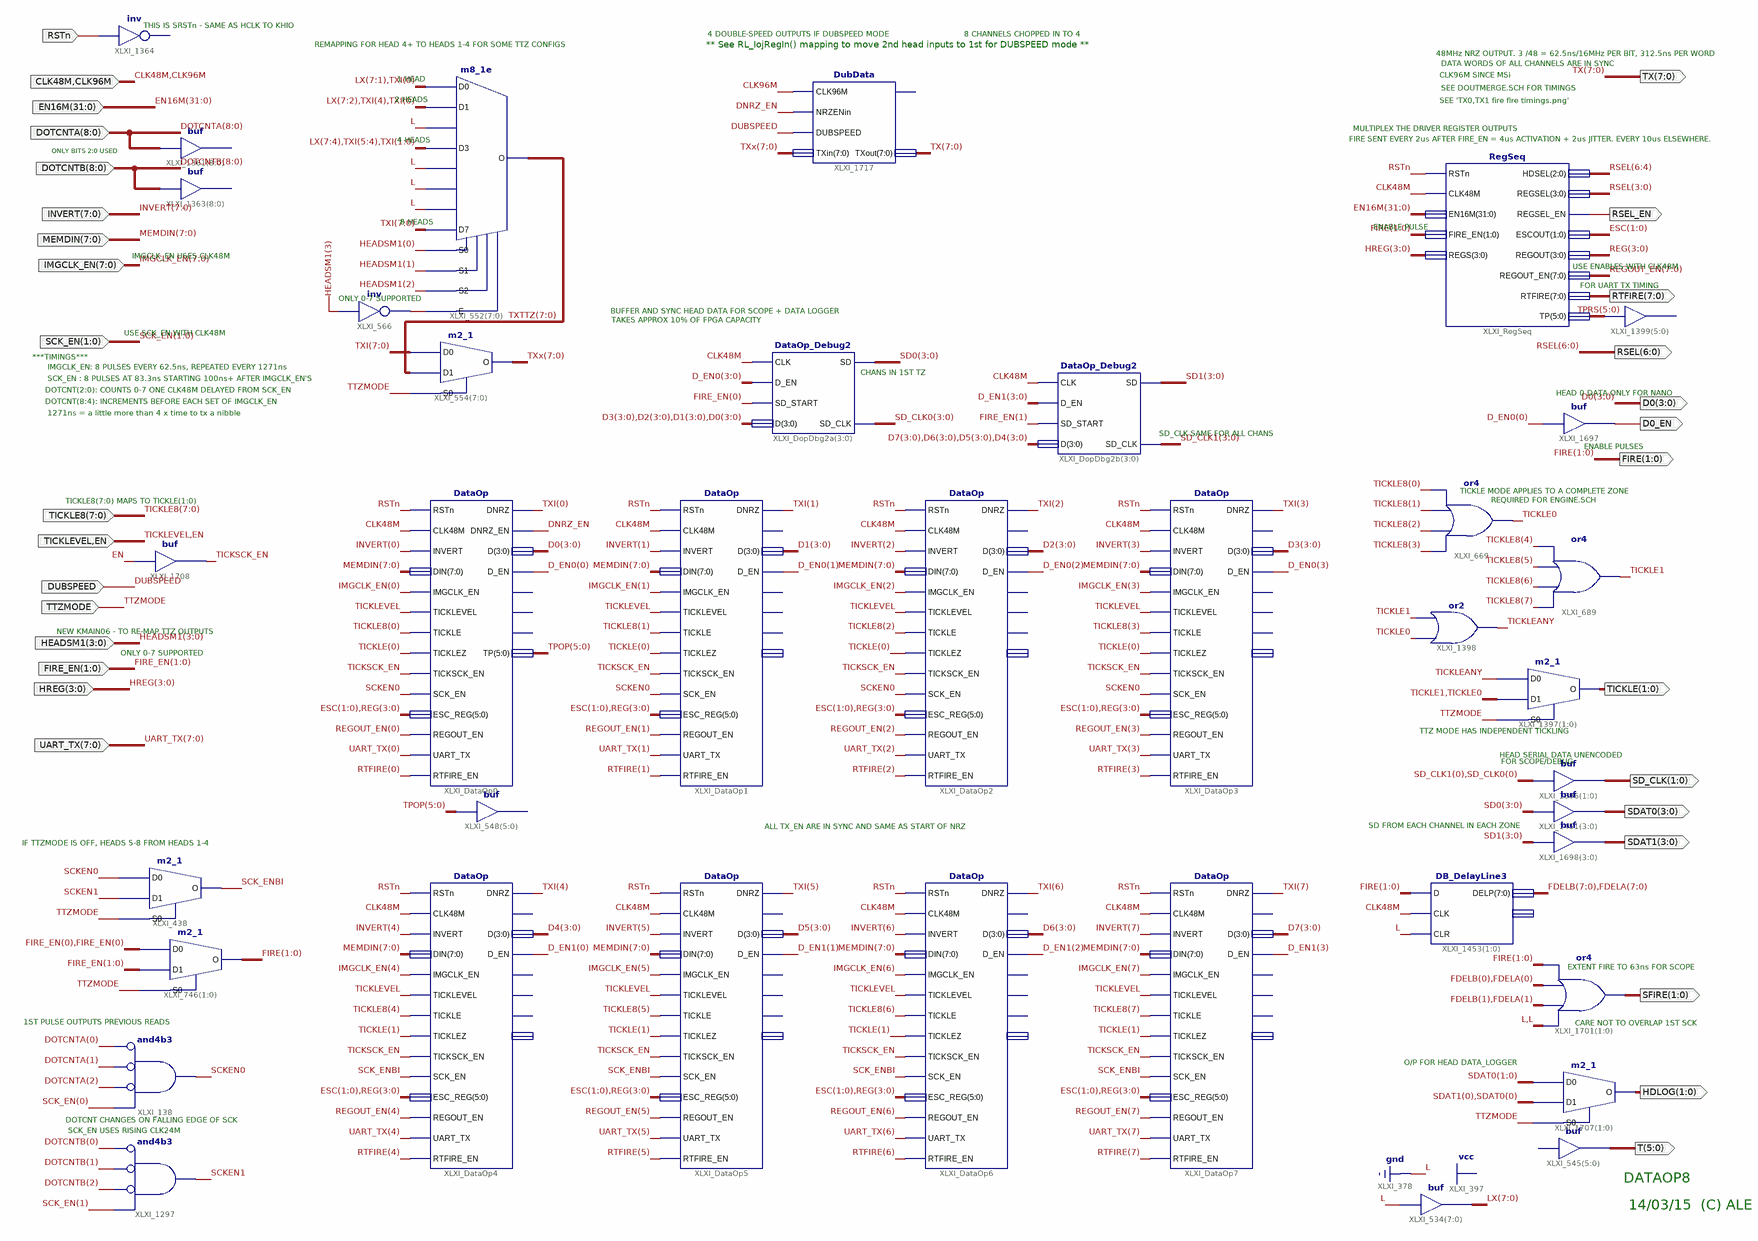
[diagram p0: schematic sheet 1]
// Xilinx ISE schematic DataOp8.sch (spartan6) as structural Verilog: 38 symbols, 33 ports
module DataOp8 (
  input  CLK48M,
  input  RSTn,
  input  [7:0] MEMDIN,
  input  TICKLEVEL,
  input  TTZMODE,
  input  [3:0] HREG,
  input  [31:0] EN16M,
  input  [1:0] FIRE_EN,
  input  [8:0] DOTCNTA,
  input  [7:0] INVERT,
  input  [7:0] IMGCLK_EN,
  input  [1:0] SCK_EN,
  input  [8:0] DOTCNTB,
  input  [3:0] HEADSM1,
  input  [7:0] UART_TX,
  input  DUBSPEED,
  input  EN,
  input  [7:0] TICKLE8,
  input  CLK96M,
  output [7:0] TX,
  output [3:0] D0,
  output D0_EN,
  output [1:0] FIRE,
  output [5:0] T,
  output RSEL_EN,
  output [6:0] RSEL,
  output [1:0] TICKLE,
  output [7:0] RTFIRE,
  output [1:0] SD_CLK,
  output [3:0] SDAT0,
  output [3:0] SDAT1,
  output [1:0] SFIRE,
  output [1:0] HDLOG
);

  wire DNRZ_EN, SCK_ENBI, SCKEN0, SCKEN1, TICKLE0, TICKLE1, TICKLEANY, TICKSCK_EN, XLXN_1078;
  wire [1:0] ESC;
  wire [3:0] D1, D2, D3, D4, D5, D6, D7, D_EN0, D_EN1, REG, SD0, SD1, SD_CLK0, SD_CLK1;
  wire [5:0] TPOP, TPRS;
  wire [7:0] FDELA, FDELB, LX, REGOUT_EN, TXI, TXTTZ, TXx;

  assign LX = {8{1'b0}};  // buf XLXI_534[7..0], 8 bits wide
  m8_1e XLXI_552[7:0] (
    .D0({LX[7:1], TXI[0]}), .D1({LX[7:2], TXI[4], TXI[0]}), .D2(1'b0), .D3({LX[7:4], TXI[5:4], TXI[1:0]}),
    .D4(1'b0), .D5(1'b0), .D6(1'b0), .D7(TXI), .E(XLXN_1078), .S0(HEADSM1[0]), .S1(HEADSM1[1]),
    .S2(HEADSM1[2]), .O(TXTTZ));
  not XLXI_566 (XLXN_1078, HEADSM1[3]);
  m2_1 XLXI_554[7:0] (.D0(TXI), .D1(TXTTZ), .S0(TTZMODE), .O(TXx));
  // buf XLXI_1361[8..0] has open pins: I=DOTCNTA, O=open
  // buf XLXI_1363[8..0] has open pins: I=DOTCNTB, O=open
  // inv XLXI_1364 has open pins: I=RSTn, O=open
  // buf XLXI_545[5..0] has open pins: I=open, O=T
  RegSeq XLXI_RegSeq (
    .CLK48M(CLK48M), .EN16M(EN16M), .ESCOUT(ESC), .FIRE_EN(FIRE), .HDSEL(RSEL[6:4]), .REGOUT(REG),
    .REGOUT_EN(REGOUT_EN), .REGS(HREG), .REGSEL(RSEL[3:0]), .REGSEL_EN(RSEL_EN), .RSTn(RSTn),
    .RTFIRE(RTFIRE), .TP(TPRS));
  or XLXI_689 (TICKLE1, TICKLE8[7], TICKLE8[6], TICKLE8[5], TICKLE8[4]);
  m2_1 XLXI_1397[1:0] (.D0(TICKLEANY), .D1({TICKLE1, TICKLE0}), .S0(TTZMODE), .O(TICKLE));
  // buf XLXI_1399[5..0] has open pins: I=TPRS, O=open
  or XLXI_1398 (TICKLEANY, TICKLE0, TICKLE1);
  or XLXI_669 (TICKLE0, TICKLE8[3], TICKLE8[2], TICKLE8[1], TICKLE8[0]);
  DataOp XLXI_DataOp0 (
    .CLK48M(CLK48M), .D(D0), .DIN(MEMDIN), .DNRZ(TXI[0]), .DNRZ_EN(DNRZ_EN), .D_EN(D_EN0[0]),
    .ESC_REG({ESC, REG}), .IMGCLK_EN(IMGCLK_EN[0]), .INVERT(INVERT[0]), .REGOUT_EN(REGOUT_EN[0]),
    .RSTn(RSTn), .RTFIRE_EN(RTFIRE[0]), .SCK_EN(SCKEN0), .TICKLE(TICKLE8[0]), .TICKLEVEL(TICKLEVEL),
    .TICKLEZ(TICKLE[0]), .TICKSCK_EN(TICKSCK_EN), .TP(TPOP), .UART_TX(UART_TX[0]));  // open: IDLE, SD, SD_CLK
  DataOp XLXI_DataOp1 (
    .CLK48M(CLK48M), .D(D1), .DIN(MEMDIN), .DNRZ(TXI[1]), .D_EN(D_EN0[1]), .ESC_REG({ESC, REG}),
    .IMGCLK_EN(IMGCLK_EN[1]), .INVERT(INVERT[1]), .REGOUT_EN(REGOUT_EN[1]), .RSTn(RSTn),
    .RTFIRE_EN(RTFIRE[1]), .SCK_EN(SCKEN0), .TICKLE(TICKLE8[1]), .TICKLEVEL(TICKLEVEL), .TICKLEZ(TICKLE[0]),
    .TICKSCK_EN(TICKSCK_EN), .UART_TX(UART_TX[1]));  // open: DNRZ_EN, IDLE, SD, SD_CLK, TP
  DataOp XLXI_DataOp2 (
    .CLK48M(CLK48M), .D(D2), .DIN(MEMDIN), .DNRZ(TXI[2]), .D_EN(D_EN0[2]), .ESC_REG({ESC, REG}),
    .IMGCLK_EN(IMGCLK_EN[2]), .INVERT(INVERT[2]), .REGOUT_EN(REGOUT_EN[2]), .RSTn(RSTn),
    .RTFIRE_EN(RTFIRE[2]), .SCK_EN(SCKEN0), .TICKLE(TICKLE8[2]), .TICKLEVEL(TICKLEVEL), .TICKLEZ(TICKLE[0]),
    .TICKSCK_EN(TICKSCK_EN), .UART_TX(UART_TX[2]));  // open: DNRZ_EN, IDLE, SD, SD_CLK, TP
  DataOp XLXI_DataOp3 (
    .CLK48M(CLK48M), .D(D3), .DIN(MEMDIN), .DNRZ(TXI[3]), .D_EN(D_EN0[3]), .ESC_REG({ESC, REG}),
    .IMGCLK_EN(IMGCLK_EN[3]), .INVERT(INVERT[3]), .REGOUT_EN(REGOUT_EN[3]), .RSTn(RSTn),
    .RTFIRE_EN(RTFIRE[3]), .SCK_EN(SCKEN0), .TICKLE(TICKLE8[3]), .TICKLEVEL(TICKLEVEL), .TICKLEZ(TICKLE[0]),
    .TICKSCK_EN(TICKSCK_EN), .UART_TX(UART_TX[3]));  // open: DNRZ_EN, IDLE, SD, SD_CLK, TP
  DataOp XLXI_DataOp4 (
    .CLK48M(CLK48M), .D(D4), .DIN(MEMDIN), .DNRZ(TXI[4]), .D_EN(D_EN1[0]), .ESC_REG({ESC, REG}),
    .IMGCLK_EN(IMGCLK_EN[4]), .INVERT(INVERT[4]), .REGOUT_EN(REGOUT_EN[4]), .RSTn(RSTn),
    .RTFIRE_EN(RTFIRE[4]), .SCK_EN(SCK_ENBI), .TICKLE(TICKLE8[4]), .TICKLEVEL(TICKLEVEL),
    .TICKLEZ(TICKLE[1]), .TICKSCK_EN(TICKSCK_EN), .UART_TX(UART_TX[4]));  // open: DNRZ_EN, IDLE, SD, SD_CLK, TP
  DataOp XLXI_DataOp5 (
    .CLK48M(CLK48M), .D(D5), .DIN(MEMDIN), .DNRZ(TXI[5]), .D_EN(D_EN1[1]), .ESC_REG({ESC, REG}),
    .IMGCLK_EN(IMGCLK_EN[5]), .INVERT(INVERT[5]), .REGOUT_EN(REGOUT_EN[5]), .RSTn(RSTn),
    .RTFIRE_EN(RTFIRE[5]), .SCK_EN(SCK_ENBI), .TICKLE(TICKLE8[5]), .TICKLEVEL(TICKLEVEL),
    .TICKLEZ(TICKLE[1]), .TICKSCK_EN(TICKSCK_EN), .UART_TX(UART_TX[5]));  // open: DNRZ_EN, IDLE, SD, SD_CLK, TP
  DataOp XLXI_DataOp6 (
    .CLK48M(CLK48M), .D(D6), .DIN(MEMDIN), .DNRZ(TXI[6]), .D_EN(D_EN1[2]), .ESC_REG({ESC, REG}),
    .IMGCLK_EN(IMGCLK_EN[6]), .INVERT(INVERT[6]), .REGOUT_EN(REGOUT_EN[6]), .RSTn(RSTn),
    .RTFIRE_EN(RTFIRE[6]), .SCK_EN(SCK_ENBI), .TICKLE(TICKLE8[6]), .TICKLEVEL(TICKLEVEL),
    .TICKLEZ(TICKLE[1]), .TICKSCK_EN(TICKSCK_EN), .UART_TX(UART_TX[6]));  // open: DNRZ_EN, IDLE, SD, SD_CLK, TP
  DataOp XLXI_DataOp7 (
    .CLK48M(CLK48M), .D(D7), .DIN(MEMDIN), .DNRZ(TXI[7]), .D_EN(D_EN1[3]), .ESC_REG({ESC, REG}),
    .IMGCLK_EN(IMGCLK_EN[7]), .INVERT(INVERT[7]), .REGOUT_EN(REGOUT_EN[7]), .RSTn(RSTn),
    .RTFIRE_EN(RTFIRE[7]), .SCK_EN(SCK_ENBI), .TICKLE(TICKLE8[7]), .TICKLEVEL(TICKLEVEL),
    .TICKLEZ(TICKLE[1]), .TICKSCK_EN(TICKSCK_EN), .UART_TX(UART_TX[7]));  // open: DNRZ_EN, IDLE, SD, SD_CLK, TP
  and XLXI_138 (SCKEN0, ~DOTCNTA[0], ~DOTCNTA[1], ~DOTCNTA[2], SCK_EN[0]);  // and4b3
  and XLXI_1297 (SCKEN1, ~DOTCNTB[0], ~DOTCNTB[1], ~DOTCNTB[2], SCK_EN[1]);  // and4b3
  m2_1 XLXI_746[1:0] (.D0({2{FIRE_EN[0]}}), .D1(FIRE_EN), .S0(TTZMODE), .O(FIRE));
  m2_1 XLXI_438 (.D0(SCKEN0), .D1(SCKEN1), .S0(TTZMODE), .O(SCK_ENBI));
  // buf XLXI_548[5..0] has open pins: I=TPOP, O=open
  buf XLXI_1697 (D0_EN, D_EN0[0]);
  DataOp_Debug2 XLXI_DopDbg2b[3:0] (
    .CLK(CLK48M), .D_EN(D_EN1), .SD_START(FIRE_EN[1]), .D({D7, D6, D5, D4}), .SD(SD1), .SD_CLK(SD_CLK1));
  DataOp_Debug2 XLXI_DopDbg2a[3:0] (
    .CLK(CLK48M), .D_EN(D_EN0), .SD_START(FIRE_EN[0]), .D({D3, D2, D1, D0}), .SD(SD0), .SD_CLK(SD_CLK0));
  assign SD_CLK = {SD_CLK1[0], SD_CLK0[0]};  // buf XLXI_1696[1..0], 2 bits wide
  assign SDAT0 = SD0;  // buf XLXI_1451[3..0], 4 bits wide
  assign SDAT1 = SD1;  // buf XLXI_1698[3..0], 4 bits wide
  DB_DelayLine3 XLXI_1453[1:0] (.CLK(CLK48M), .CLR(1'b0), .D(FIRE), .DELP({FDELB, FDELA}));  // open: DELN
  assign SFIRE = 2'b00 | {FDELB[1], FDELA[1]} | {FDELB[0], FDELA[0]} | FIRE;  // or4 XLXI_1701[1..0], 2 bits wide
  m2_1 XLXI_1707[1:0] (.D0(SDAT0[1:0]), .D1({SDAT1[0], SDAT0[0]}), .S0(TTZMODE), .O(HDLOG));
  buf XLXI_1708 (TICKSCK_EN, EN);
  DubData XLXI_1717 (
    .CLK96M(CLK96M), .NRZENin(DNRZ_EN), .DUBSPEED(DUBSPEED), .TXin(TXx), .TXout(TX));  // open: NRZENout

  // Notes on the sheet:
  //   THIS IS SRSTn - SAME AS HCLK TO KHIO
  //   4 DOUBLE-SPEED OUTPUTS IF DUBSPEED MODE
  //   8 CHANNELS CHOPPED IN TO 4
  //   REMAPPING FOR HEAD 4+ TO HEADS 1-4 FOR SOME TTZ CONFIGS
  //   ** See RL_IojRegIn() mapping to move 2nd head inputs to 1st for DUBSPEED mode **
  //   48MHz NRZ OUTPUT. 3 /48 = 62.5ns/16MHz PER BIT, 312.5ns PER WORD
  //   DATA WORDS OF ALL CHANNELS ARE IN SYNC
  //   CLK96M SINCE MSi
  //   1 HEAD
  //   SEE DOUTMERGE.SCH FOR TIMINGS
  //   2 HEADS
  //   SEE 'TX0,TX1 fire fire timings.png'
  //   MULTIPLEX THE DRIVER REGISTER OUTPUTS
  //   FIRE SENT EVERY 2us AFTER FIRE_EN = 4us ACTIVATION + 2us JITTER. EVERY 10us ELSEWHERE.
  //   4 HEADS
  //   ONLY BITS 2:0 USED
  //   8 HEADS
  //   ENABLE PULSE
  //   IMGCLK_EN USES CLK48M
  //   USE ENABLES WITH CLK48M
  //   FOR UART TX TIMING
  //   ONLY 0-7 SUPPORTED
  //   BUFFER AND SYNC HEAD DATA FOR SCOPE + DATA LOGGER
  //   TAKES APPROX 10% OF FPGA CAPACITY
  //   USE SCK_EN WITH CLK48M
  //   ***TIMINGS***
  //   IMGCLK_EN: 8 PULSES EVERY 62.5ns, REPEATED EVERY 1271ns
  //   CHANS IN 1ST TZ
  //   SCK_EN : 8 PULSES AT 83.3ns STARTING 100ns+ AFTER IMGCLK_EN'S
  //   DOTCNT(2:0): COUNTS 0-7 ONE CLK48M DELAYED FROM SCK_EN
  //   HEAD 0 DATA ONLY FOR NANO
  //   DOTCNT(8:4): INCREMENTS BEFORE EACH SET OF IMGCLK_EN
  //   1271ns = a little more than 4 x time to tx a nibble
  //   SD_CLK SAME FOR ALL CHANS
  //   ENABLE PULSES
  //   TICKLE MODE APPLIES TO A COMPLETE ZONE
  //   REQUIRED FOR ENGINE.SCH
  //   TICKLE8(7:0) MAPS TO TICKLE(1:0)
  //   NEW KMAIN06 - TO RE-MAP TTZ OUTPUTS
  //   ONLY 0-7 SUPPORTED
  //   TTZ MODE HAS INDEPENDENT TICKLING
  //   HEAD SERIAL DATA UNENCODED
  //   FOR SCOPE/DEBUG
  //   SD FROM EACH CHANNEL IN EACH ZONE
  //   ALL TX_EN ARE IN SYNC AND SAME AS START OF NRZ
  //   IF TTZMODE IS OFF, HEADS 5-8 FROM HEADS 1-4
  //   EXTENT FIRE TO 63ns FOR SCOPE
  //   1ST PULSE OUTPUTS PREVIOUS READS
  //   CARE NOT TO OVERLAP 1ST SCK
  //   O/P FOR HEAD DATA_LOGGER
  //   DOTCNT CHANGES ON FALLING EDGE OF SCK
  //   SCK_EN USES RISING CLK24M
  //   DATAOP8
  //   14/03/15  (C) ALE
endmodule
